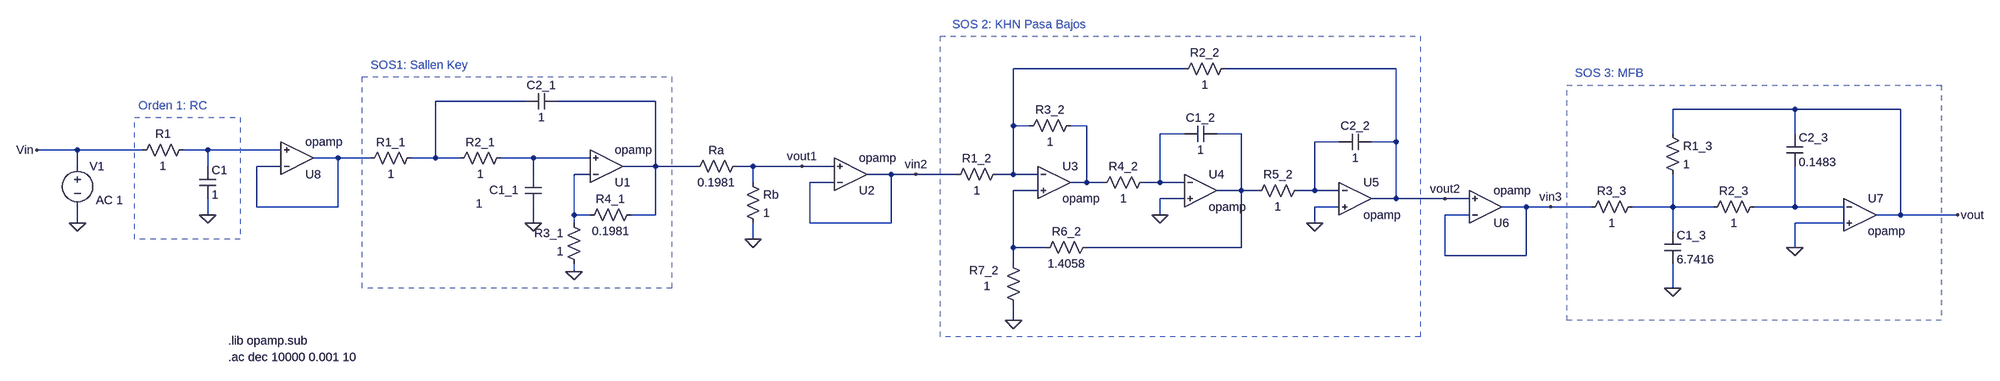
[diagram p0: schematic Bonus_PasaBajos_Orden7.asc]
Bonus_PasaBajos_Orden7.asc, the LTspice schematic file:
Version 4.1
SHEET 1 3316 680
WIRE 1248 0 912 0
WIRE 1664 0 1328 0
WIRE -48 64 -224 64
WIRE 208 64 16 64
WIRE 2448 80 2208 80
WIRE 2656 80 2448 80
WIRE 912 112 912 0
WIRE 944 112 912 112
WIRE 1056 112 1024 112
WIRE 1248 128 1200 128
WIRE 1360 128 1312 128
WIRE 2208 128 2208 80
WIRE 2448 128 2448 80
WIRE 1552 144 1504 144
WIRE 1664 144 1664 0
WIRE 1664 144 1616 144
WIRE -928 160 -1008 160
WIRE -800 160 -928 160
WIRE -672 160 -720 160
WIRE -528 160 -672 160
WIRE -416 176 -464 176
WIRE -352 176 -416 176
WIRE -224 176 -224 64
WIRE -224 176 -272 176
WIRE -176 176 -224 176
WIRE -32 176 -96 176
WIRE 80 176 -32 176
WIRE -928 192 -928 160
WIRE -672 192 -672 160
WIRE -528 192 -576 192
WIRE 208 192 208 64
WIRE 208 192 144 192
WIRE 288 192 208 192
WIRE 400 192 368 192
WIRE 496 192 400 192
WIRE 560 192 496 192
WIRE -32 208 -32 176
WIRE 80 208 48 208
WIRE 672 208 624 208
WIRE 720 208 672 208
WIRE 800 208 720 208
WIRE 912 208 912 112
WIRE 912 208 880 208
WIRE 960 208 912 208
WIRE 400 224 400 192
WIRE 560 224 512 224
WIRE 1056 224 1056 112
WIRE 1056 224 1024 224
WIRE 1088 224 1056 224
WIRE 1200 224 1200 128
WIRE 1200 224 1168 224
WIRE 1248 224 1200 224
WIRE 960 240 912 240
WIRE 1360 240 1360 128
WIRE 1360 240 1312 240
WIRE 1392 240 1360 240
WIRE 1504 240 1504 144
WIRE 1504 240 1472 240
WIRE 1552 240 1504 240
WIRE 1248 256 1200 256
WIRE 1664 256 1664 144
WIRE 1664 256 1616 256
WIRE 1760 256 1664 256
WIRE 1808 256 1760 256
WIRE -576 272 -576 192
WIRE -416 272 -416 176
WIRE -416 272 -576 272
WIRE 1552 272 1504 272
WIRE 1920 272 1872 272
WIRE 1968 272 1920 272
WIRE 2048 272 1968 272
WIRE 2208 272 2208 208
WIRE 2208 272 2128 272
WIRE 2288 272 2208 272
WIRE 2448 272 2448 192
WIRE 2448 272 2368 272
WIRE 2544 272 2448 272
WIRE -672 288 -672 256
WIRE 48 288 48 208
WIRE 80 288 48 288
WIRE 208 288 208 192
WIRE 208 288 160 288
WIRE 1200 288 1200 256
WIRE 1808 288 1760 288
WIRE 2656 288 2656 80
WIRE 2656 288 2608 288
WIRE 2768 288 2656 288
WIRE -928 304 -928 272
WIRE -32 304 -32 272
WIRE 48 304 48 288
WIRE 512 304 512 224
WIRE 672 304 672 208
WIRE 672 304 512 304
WIRE 1504 304 1504 272
WIRE 2544 304 2448 304
WIRE 2208 320 2208 272
WIRE 400 336 400 304
WIRE 912 352 912 240
WIRE 976 352 912 352
WIRE 1360 352 1360 240
WIRE 1360 352 1056 352
WIRE 2448 352 2448 304
WIRE 1760 368 1760 288
WIRE 1920 368 1920 272
WIRE 1920 368 1760 368
WIRE 912 384 912 352
WIRE 48 400 48 384
WIRE 2208 432 2208 384
WIRE 912 496 912 464
FLAG -32 304 0
FLAG -1008 160 Vin
FLAG 1200 288 0
FLAG 1504 304 0
FLAG 912 496 0
FLAG 2208 432 0
FLAG 2448 352 0
FLAG -928 304 0
FLAG 48 400 0
FLAG 400 336 0
FLAG 496 192 vout1
FLAG 720 208 vin2
FLAG 1760 256 vout2
FLAG 1968 272 vin3
FLAG 2768 288 vout
FLAG -672 288 0
SYMBOL res -256 160 R90
WINDOW 0 0 56 VBottom 2
WINDOW 3 32 56 VTop 2
SYMATTR InstName R1_1
SYMATTR Value 1
SYMBOL res -80 160 R90
WINDOW 0 0 56 VBottom 2
WINDOW 3 32 56 VTop 2
SYMATTR InstName R2_1
SYMATTR Value 1
SYMBOL cap -48 208 R0
WINDOW 0 -70 31 Left 2
WINDOW 3 -97 58 Left 2
SYMATTR InstName C1_1
SYMATTR Value 1
SYMBOL cap 16 48 R90
WINDOW 0 0 32 VBottom 2
WINDOW 3 32 32 VTop 2
SYMATTR InstName C2_1
SYMATTR Value 1
SYMBOL OpAmps\\opamp 112 256 M180
SYMATTR InstName U1
SYMBOL OpAmps\\opamp 592 272 M180
SYMATTR InstName U2
SYMBOL res 896 192 R90
WINDOW 0 0 56 VBottom 2
WINDOW 3 32 56 VTop 2
SYMATTR InstName R1_2
SYMATTR Value 1
SYMBOL res 1232 16 R270
WINDOW 0 32 56 VTop 2
WINDOW 3 0 56 VBottom 2
SYMATTR InstName R2_2
SYMATTR Value 1
SYMBOL res 928 128 R270
WINDOW 0 32 56 VTop 2
WINDOW 3 0 56 VBottom 2
SYMATTR InstName R3_2
SYMATTR Value 1
SYMBOL res 1072 240 R270
WINDOW 0 32 56 VTop 2
WINDOW 3 0 56 VBottom 2
SYMATTR InstName R4_2
SYMATTR Value 1
SYMBOL res 1376 256 R270
WINDOW 0 32 56 VTop 2
WINDOW 3 0 56 VBottom 2
SYMATTR InstName R5_2
SYMATTR Value 1
SYMBOL res 960 368 R270
WINDOW 0 32 56 VTop 2
WINDOW 3 0 56 VBottom 2
SYMATTR InstName R6_2
SYMATTR Value 1.4058
SYMBOL res 896 368 R0
WINDOW 0 -71 29 Left 2
WINDOW 3 -43 60 Left 2
SYMATTR InstName R7_2
SYMATTR Value 1
SYMBOL cap 1312 112 R90
WINDOW 0 0 32 VBottom 2
WINDOW 3 32 32 VTop 2
SYMATTR InstName C1_2
SYMATTR Value 1
SYMBOL cap 1616 128 R90
WINDOW 0 0 32 VBottom 2
WINDOW 3 32 32 VTop 2
SYMATTR InstName C2_2
SYMATTR Value 1
SYMBOL OpAmps\\opamp 992 160 R0
SYMATTR InstName U3
SYMBOL OpAmps\\opamp 1280 176 R0
SYMATTR InstName U4
SYMBOL OpAmps\\opamp 1584 192 R0
SYMATTR InstName U5
SYMBOL OpAmps\\opamp 1840 336 M180
SYMATTR InstName U6
SYMBOL res 2192 112 R0
SYMATTR InstName R1_3
SYMATTR Value 1
SYMBOL res 2384 256 R90
WINDOW 0 0 56 VBottom 2
WINDOW 3 32 56 VTop 2
SYMATTR InstName R2_3
SYMATTR Value 1
SYMBOL res 2144 256 R90
WINDOW 0 0 56 VBottom 2
WINDOW 3 32 56 VTop 2
SYMATTR InstName R3_3
SYMATTR Value 1
SYMBOL cap 2192 320 R0
SYMATTR InstName C1_3
SYMATTR Value 6.7416
SYMBOL cap 2432 128 R0
SYMATTR InstName C2_3
SYMATTR Value 0.1483
SYMBOL OpAmps\\opamp 2576 224 R0
SYMATTR InstName U7
SYMBOL voltage -928 176 R0
WINDOW 123 36 83 Left 2
WINDOW 39 0 0 Left 0
SYMATTR Value2 AC 1
SYMATTR InstName V1
SYMATTR Value ""
SYMBOL res 176 272 R90
WINDOW 0 0 56 VBottom 2
WINDOW 3 32 56 VTop 2
SYMATTR InstName R4_1
SYMATTR Value 0.1981
SYMBOL res 64 400 R180
WINDOW 0 36 76 Left 2
WINDOW 3 36 40 Left 2
SYMATTR InstName R3_1
SYMATTR Value 1
SYMBOL res 384 208 R0
SYMATTR InstName Rb
SYMATTR Value 1
SYMBOL res 384 176 R90
WINDOW 0 0 56 VBottom 2
WINDOW 3 32 56 VTop 2
SYMATTR InstName Ra
SYMATTR Value 0.1981
SYMBOL OpAmps\\opamp -496 240 M180
SYMATTR InstName U8
SYMBOL res -704 144 R90
WINDOW 0 0 56 VBottom 2
WINDOW 3 32 56 VTop 2
SYMATTR InstName R1
SYMATTR Value 1
SYMBOL cap -688 192 R0
SYMATTR InstName C1
SYMATTR Value 1
TEXT -632 536 Left 2 !.lib opamp.sub
TEXT -352 -8 Left 2 ;SOS1: Sallen Key
TEXT 792 -88 Left 2 ;SOS 2: KHN Pasa Bajos
TEXT 2016 8 Left 2 ;SOS 3: MFB
TEXT -632 568 Left 2 !.ac dec 10000 0.001 10
TEXT -808 72 Left 2 ;Orden 1: RC
RECTANGLE Normal 1712 528 768 -64 2
RECTANGLE Normal 2736 496 2000 32 2
RECTANGLE Normal 240 432 -368 16 2
RECTANGLE Normal -608 336 -816 96 2

The netlist it stands for:
* Bonus_PasaBajos_Orden7.asc
R1_1 N002 N009 1
R2_1 N010 N002 1
C1_1 N010 0 1
C2_1 N003 N002 1
X§U1 N011 N010 N003 opamp Aol=100K GBW=10Meg  ; pins invin noninvin out
X§U2 vin2 vout1 vin2 opamp Aol=100K GBW=10Meg  ; pins invin noninvin out
R1_2 N001 vin2 1
R2_2 N001 vout2 1
R3_2 N001 N004 1
R4_2 N004 N005 1
R5_2 N006 N007 1
R6_2 N012 N006 1.4058
R7_2 N012 0 1
C1_2 N006 N005 1
C2_2 vout2 N007 1
X§U3 N001 N012 N004 opamp Aol=100K GBW=10Meg  ; pins invin noninvin out
X§U4 N005 0 N006 opamp Aol=100K GBW=10Meg  ; pins invin noninvin out
X§U5 N007 0 vout2 opamp Aol=100K GBW=10Meg  ; pins invin noninvin out
X§U6 vin3 vout2 vin3 opamp Aol=100K GBW=10Meg  ; pins invin noninvin out
R1_3 vout N013 1
R2_3 N014 N013 1
R3_3 N013 vin3 1
C1_3 N013 0 6.7416
C2_3 vout N014 0.1483
X§U7 N014 0 vout opamp Aol=100K GBW=10Meg  ; pins invin noninvin out
V1 Vin 0 AC 1
R4_1 N003 N011 0.1981
R3_1 0 N011 1
Rb vout1 0 1
Ra vout1 N003 0.1981
X§U8 N009 N008 N009 opamp Aol=100K GBW=10Meg  ; pins invin noninvin out
R1 N008 Vin 1
C1 N008 0 1
.lib opamp.sub
* SOS1: Sallen Key
* SOS 2: KHN Pasa Bajos
* SOS 3: MFB
.ac dec 10000 0.001 10
* Orden 1: RC
.backanno
.end